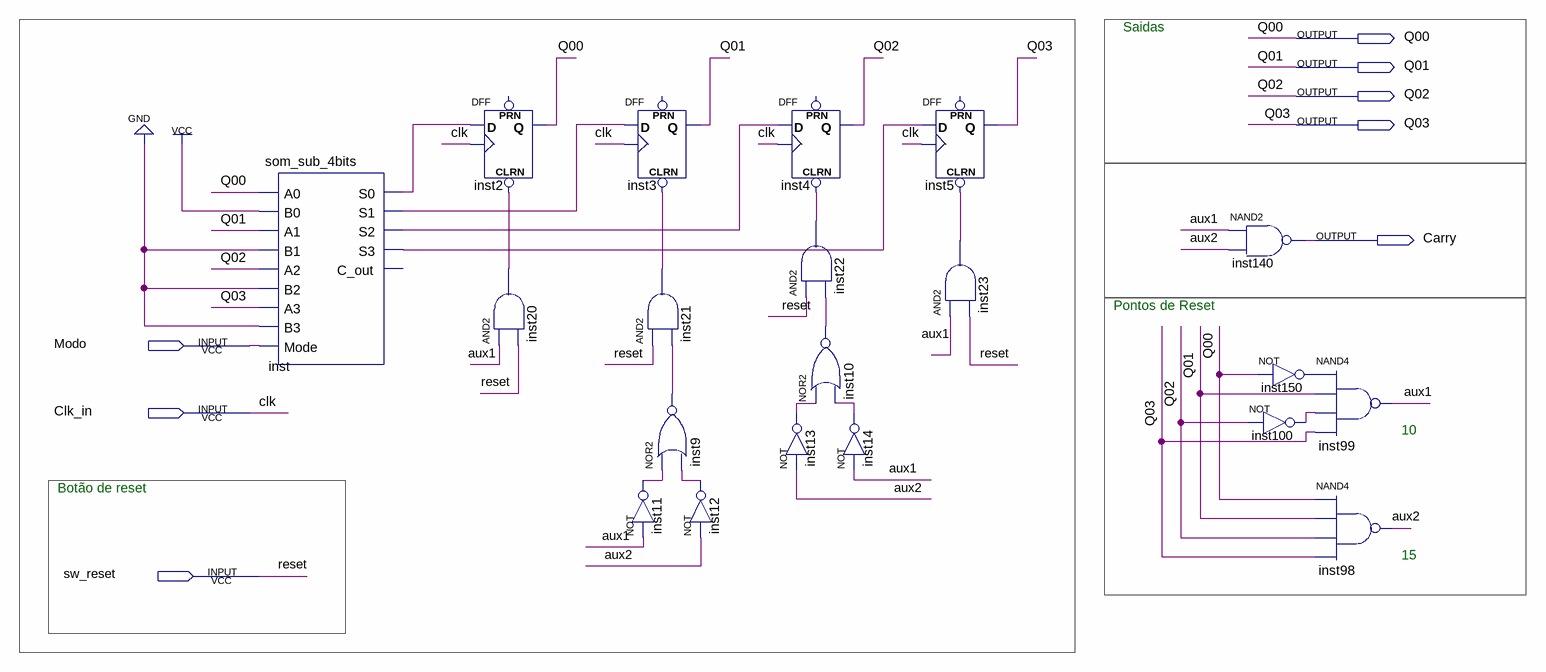
[diagram p0: schematic sheet]
// Quartus schematic somador_condicional.bdf as structural Verilog: 20 symbols, 8 pins
module somador_condicional (
  input  Modo,
  input  Clk_in,
  input  sw_reset,
  output Q00,
  output Q01,
  output Q02,
  output Q03,
  output Carry
);

  wire aux1, aux2, inst9_out, inst10_out, inst11_out, inst12_out, inst13_out, inst14_out, inst20_out,
       inst21_out, inst22_out, inst23_out, inst100_out, inst150_out, inst_s0, inst_s1, inst_s2, inst_s3;

  som_sub_4bits inst (
    .A0(Q00), .B0(1'b1), .A1(Q01), .B1(1'b0), .A2(Q02), .B2(1'b0), .A3(Q03), .B3(1'b0), .Mode(Modo),
    .S0(inst_s0), .S1(inst_s1), .S2(inst_s2), .S3(inst_s3));  // open: C_out
  DFF inst2 (.CLRN(inst20_out), .CLK(Clk_in), .D(inst_s0), .Q(Q00));  // open: PRN
  and inst20 (inst20_out, aux1, sw_reset);
  DFF inst3 (.CLRN(inst21_out), .CLK(Clk_in), .D(inst_s1), .Q(Q01));  // open: PRN
  and inst21 (inst21_out, sw_reset, inst9_out);
  nor inst9 (inst9_out, inst11_out, inst12_out);
  not inst11 (inst11_out, aux1);
  not inst12 (inst12_out, aux2);
  DFF inst4 (.CLRN(inst22_out), .CLK(Clk_in), .D(inst_s2), .Q(Q02));  // open: PRN
  and inst22 (inst22_out, sw_reset, inst10_out);
  nor inst10 (inst10_out, inst13_out, inst14_out);
  not inst13 (inst13_out, aux2);
  not inst14 (inst14_out, aux1);
  DFF inst5 (.CLRN(inst23_out), .CLK(Clk_in), .D(inst_s3), .Q(Q03));  // open: PRN
  and inst23 (inst23_out, aux1, sw_reset);
  nand inst140 (Carry, aux1, aux2);
  not inst150 (inst150_out, Q00);
  not inst100 (inst100_out, Q02);
  nand inst99 (aux1, inst150_out, Q01, inst100_out, Q03);
  nand inst98 (aux2, Q00, Q01, Q02, Q03);

  // Other names for the same wires on the sheet: clk = Clk_in; reset = sw_reset

  // Notes on the sheet:
  //   Saidas
  //   Pontos de Reset
  //   10
  //   Botão de reset
  //   15
endmodule
